# EasyEDA schematic schematics.json
TITLE: Schematics; REV: 1.0; Date: 2024-04-20; Sheet: 1/1; Drawn By: arashsaifi0
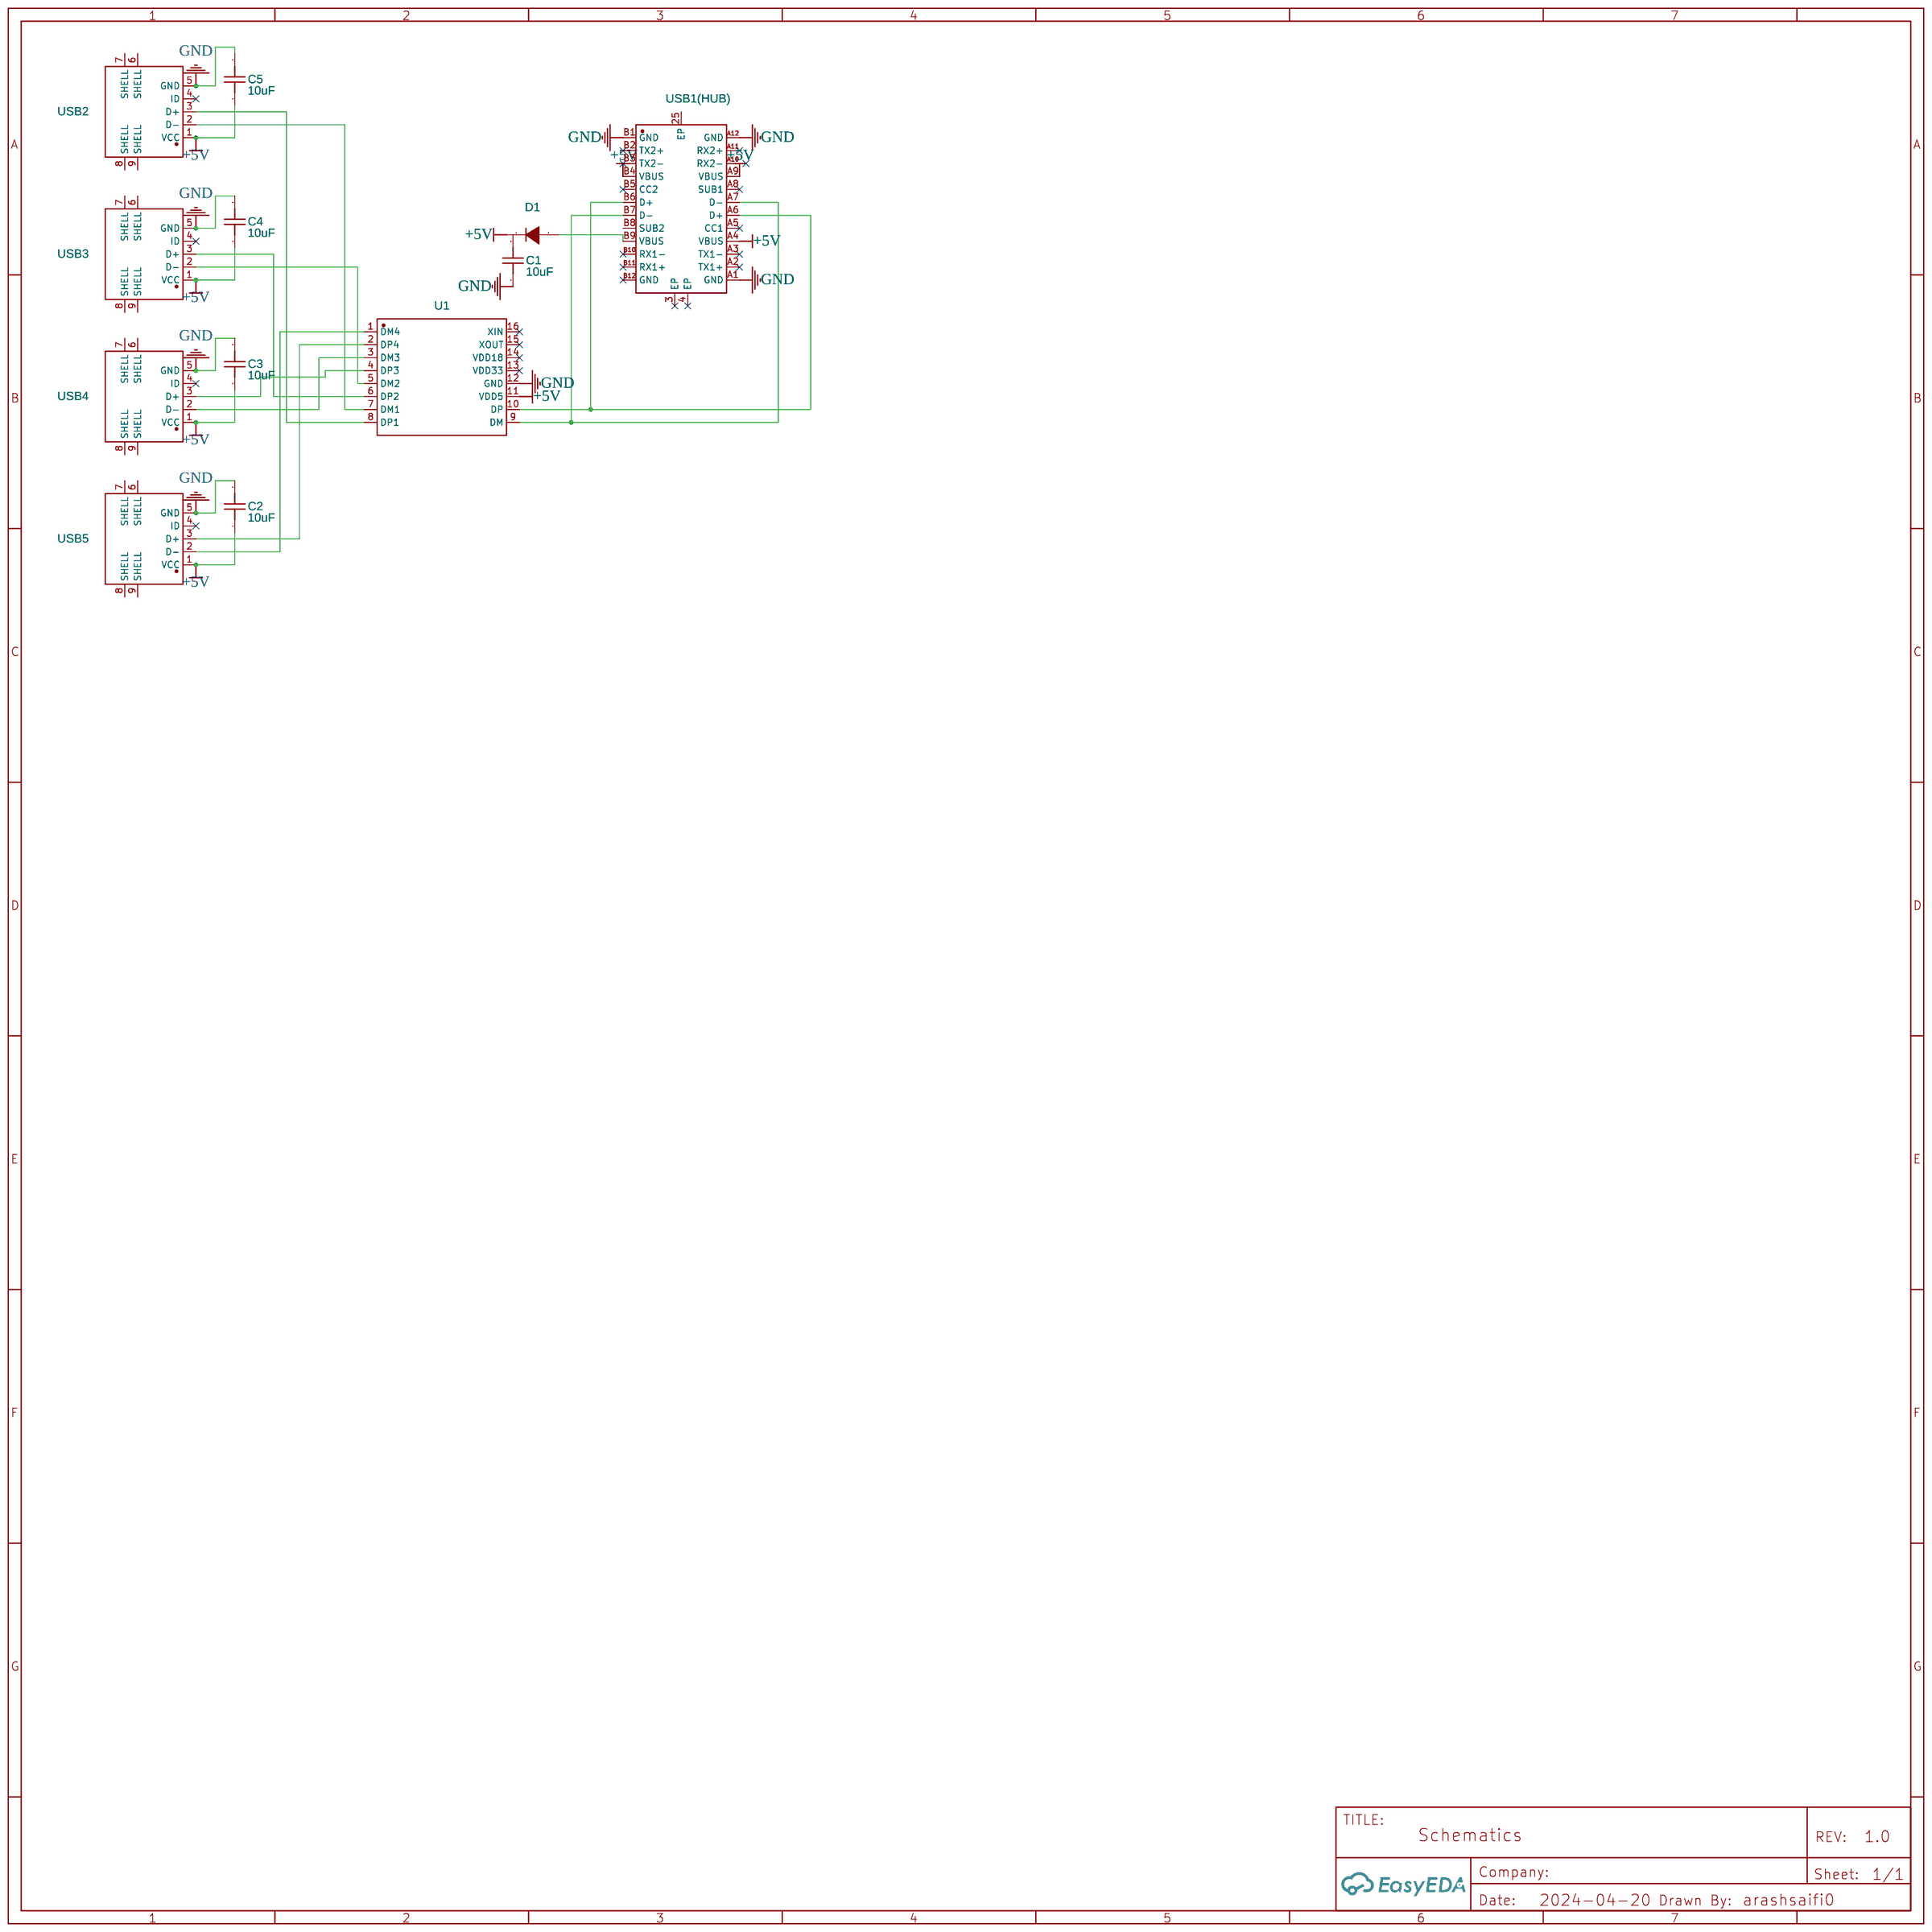
[diagram p0: schematic sheet]

## Parts
C1  10uF  [C0603]
C2  10uF  [C0603]
C3  10uF  [C0603]
C4  10uF  [C0603]
C5  10uF  [C0603]
D1  NSR0320MW2T1G  [SOD-323_L1.8-W1.3-LS2.5-RD]
U1  SL2.1A  [SOP-16_L10.0-W3.9-P1.27-LS6.0-BL]
USB1(HUB)  TYPE-C 24P QT  [USB-C-SMD_TYPE-C-24P-QT]
USB2  U224-051N-3GRA035  [USB-A-TH_U224-051N-3GRA035]
USB3  U224-051N-3GRA035  [USB-A-TH_U224-051N-3GRA035]
USB4  U224-051N-3GRA035  [USB-A-TH_U224-051N-3GRA035]
USB5  U224-051N-3GRA035  [USB-A-TH_U224-051N-3GRA035]

## Library data of the parts
C1-C5 = CL10A106KP8NNNC: Supplier: LCSC; Manufacturer: SAMSUNG(三星); Supplier Part: C19702; JLCPCB Part Class: Basic Part
D1 = NSR0320MW2T1G: Supplier: LCSC; Manufacturer: onsemi(安森美); Supplier Part: C48192; JLCPCB Part Class: Extended Part
U1 = SL2.1A: Contributor: LCSC; Supplier: LCSC; Supplier Part: C192893; Manufacturer: CoreChips(和芯润德); JLCPCB Part Class: Extended Part
USB1(HUB) = TYPE-C 24P QT: Contributor: LCSC; Supplier: LCSC; Supplier Part: C2681555; Manufacturer: SHOU HAN(首韩)
USB2-USB5 = U224-051N-3GRA035: Supplier: LCSC; Supplier Part: C2689740; Manufacturer: XKB Connectivity(中国星坤); Contributor: lcsc; JLCPCB Part Class: Extended Part

## Nets
+5V: C2.1 C3.1 C4.1 C5.1 D1.1(C) U1.11(VDD5) USB1(HUB).A4(VBUS) USB1(HUB).A9(VBUS) USB1(HUB).B4(VBUS) USB2.1(VCC) USB3.1(VCC) USB4.1(VCC) USB5.1(VCC)
GND: C1.1 C2.2 C3.2 C4.2 C5.2 U1.12(GND) USB1(HUB).A1(GND) USB1(HUB).A12(GND) USB1(HUB).B1(GND) USB2.5(GND) USB3.5(GND) USB4.5(GND) USB5.5(GND)
Net-(D1-2): D1.2(A) USB1(HUB).B9(VBUS)
Net-(U1-1): U1.1(DM4) USB5.2(D-)
Net-(U1-2): U1.2(DP4) USB5.3(D+)
Net-(U1-3): U1.3(DM3) USB4.2(D-)
Net-(U1-4): U1.4(DP3) USB4.3(D+)
Net-(U1-5): U1.5(DM2) USB3.2(D-)
Net-(U1-6): U1.6(DP2) USB3.3(D+)
Net-(U1-7): U1.7(DM1) USB2.2(D-)
Net-(U1-8): U1.8(DP1) USB2.3(D+)
Net-(U1-9): U1.9(DM) USB1(HUB).A7(D-) USB1(HUB).B7(D-)
Net-(U1-10): U1.10(DP) USB1(HUB).A6(D+) USB1(HUB).B6(D+)

Not connected (* = marked no-connect by the designer): C1 2; U1 13(VDD33)* 14(VDD18)* 15(XOUT)* 16(XIN)*; USB1(HUB) 3(EP)* 4(EP)* 25(EP) A2(TX1+)* A3(TX1-)* A5(CC1)* A8(SUB1)* A10(RX2-) A11(RX2+)* B2(TX2+)* B3(TX2-)* B5(CC2)* B8(SUB2) B10(RX1-)* B11(RX1+)* B12(GND)*; USB2 4(ID)* 6(SHELL) 7(SHELL) 8(SHELL) 9(SHELL); USB3 4(ID)* 6(SHELL) 7(SHELL) 8(SHELL) 9(SHELL); USB4 4(ID)* 6(SHELL) 7(SHELL) 8(SHELL) 9(SHELL); USB5 4(ID)* 6(SHELL) 7(SHELL) 8(SHELL) 9(SHELL)
